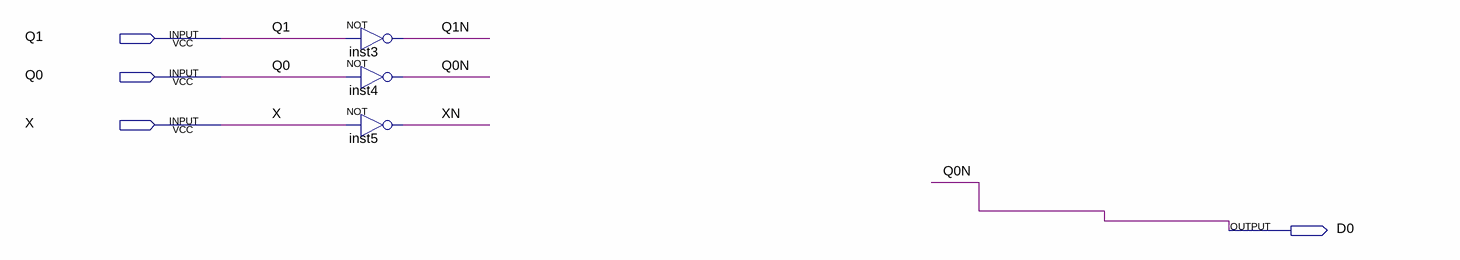
[diagram p0: schematic sheet]
// Quartus schematic D0.bdf as structural Verilog: 3 symbols, 4 pins
module D0 (
  input  Q1,
  input  Q0,
  input  X,
  output D0
);

  wire Q1N, XN;

  not inst3 (Q1N, Q1);
  not inst4 (D0, Q0);
  not inst5 (XN, X);

  // Other names for the same wires on the sheet: Q0N = D0
endmodule
